# EAGLE design GaggiaBoard_V3 (EAGLE 9.6.2)

## Sheet 1 of 2
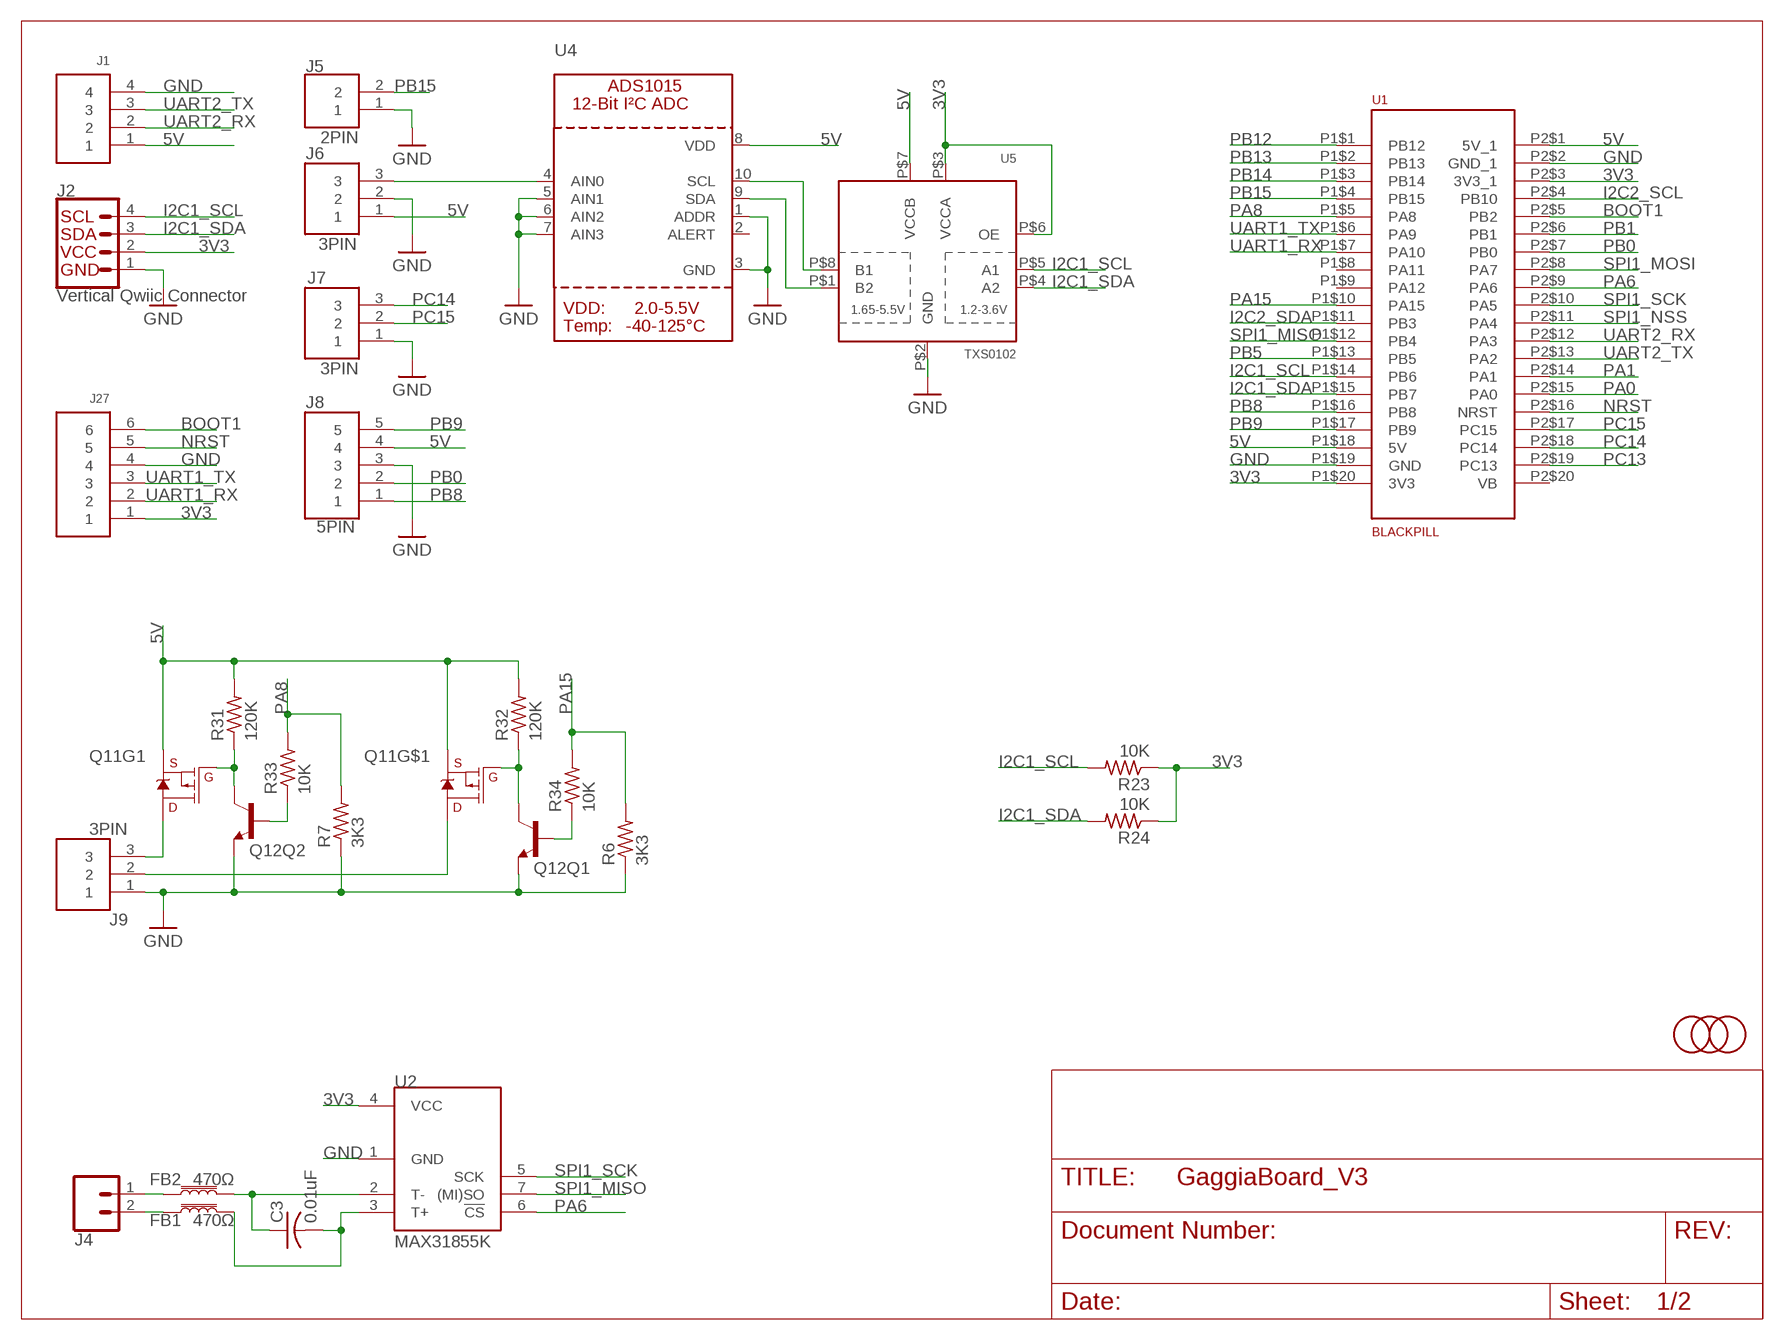
[diagram p0: schematic, sheet 1]

### Parts
C3  0.01uF  C-USC0603  [C0603]
FB1  470Ω  FERRITE_BEAD-0603-470Ω-100MHZ-1A-200MILIΩ  [0603]
FB2  470Ω  FERRITE_BEAD-0603-470Ω-100MHZ-1A-200MILIΩ  [0603]
J1  4PIN  [B4B-PH-K-S]
J2  Vertical Qwiic Connector  QWIIC_CONNECTOR  [JST04_1MM_VERT]
J4  CONN_023.5MM-NO_SILK  [SCREWTERMINAL-3.5MM-2-NS]
J5  2PIN  [B2B-PH-K-S]
J6  3PIN  [B3B-PH-K-S]
J7  3PIN  [B3B-PH-K-S]
J8  5PIN  [B5B-PH-K-S]
J9  3PIN  [B3B-PH-K-S]
J27  6PIN  [B6B-PH-K-S]
MARK1  FIDUCIAL  [FIDUCIAL_1MM]
MARK2  FIDUCIAL  [FIDUCIAL_1MM]
MARK5  FIDUCIAL  [FIDUCIAL_1MM]
Q11  MOSFET_PCH_DUAL-DMP2240UDM  [SOT26]
Q12  TRANS_NPN_DUAL-MBT3904DW1T1  [SC70-6]
R6  3K3  R-US_R0603  [R0603]
R7  3K3  R-US_R0603  [R0603]
R23  10K  R-US_R0603  [R0603]
R24  10K  R-US_R0603  [R0603]
R31  120K  R-US_R0603  [R0603]
R32  120K  R-US_R0603  [R0603]
R33  10K  R-US_R0603  [R0603]
R34  10K  R-US_R0603  [R0603]
U1  BLACKPILL  [BLACKPILL]
U2  MAX31855K  [SO08]
U4  ADC_ADS1015  [MSOP10]
U5  TXS0102  [VFSOP-8]

### Nets
3V3: J2.2 J27.1 R23.1 R24.1 U1.P1$20(3V3) U1.P2$3(3V3_1) U2.4(VCC) U5.P$3(VCCA) U5.P$6(OE) ; also sheet 2
5V: J1.1 J6.1 J8.4 Q11.S1(S) Q11.S2(S) R31.2 R32.2 U1.P1$18(5V) U1.P2$1(5V_1) U4.8(VDD) U5.P$7(VCCB) ; also sheet 2
BOOT1: J27.6 U1.P2$5(PB2)
GND: J1.4 J2.1 J5.1 J6.2 J7.1 J8.3 J9.1 J27.4 Q12.1(Q2:E) Q12.4(Q1:E) R6.1 R7.1 U1.P1$19(GND) U1.P2$2(GND_1) U2.1(GND) U4.1(ADDR) U4.3(GND) U4.5(AIN1) U4.6(AIN2) U4.7(AIN3) U5.P$2(GND) ; also sheet 2
I2C1_SCL: J2.4 R23.2 U1.P1$14(PB6) U5.P$5(A1)
I2C1_SDA: J2.3 R24.2 U1.P1$15(PB7) U5.P$4(A2)
I2C2_SCL: U1.P2$4(PB10)
I2C2_SDA: U1.P1$11(PB3)
N$3 [TC]: FB2.1 J4.1
N$4 [TC]: FB1.1 J4.2
N$5 [TC]: C3.1 FB2.2 U2.2(T-)
N$6: J9.3 Q11.D1(D)
N$10: J9.2 Q11.D2(D)
N$22: U4.10(SCL) U5.P$8(B1)
N$26 [TC]: C3.2 FB1.2 U2.3(T+)
N$38: U4.9(SDA) U5.P$1(B2)
N$46: Q12.2(Q2:B) R33.1
N$47: Q11.G2(G) Q12.3(Q1:C) R32.1
N$48: Q11.G1(G) Q12.6(Q2:C) R31.1
N$49: Q12.5(Q1:B) R34.1
NRST: J27.5 U1.P2$16(NRST)
PA0: U1.P2$15(PA0) ; also sheet 2
PA1: U1.P2$14(PA1) ; also sheet 2
PA6: U1.P2$9(PA6) U2.6(!CS)
PA8: R7.2 R33.2 U1.P1$5(PA8)
PA15: R6.2 R34.2 U1.P1$10(PA15)
PB0: J8.2 U1.P2$7(PB0)
PB1: U1.P2$6(PB1)
PB5: U1.P1$13(PB5)
PB8: J8.1 U1.P1$16(PB8)
PB9: J8.5 U1.P1$17(PB9)
PB12: U1.P1$1(PB12)
PB13: U1.P1$2(PB13)
PB14: U1.P1$3(PB14)
PB15: J5.2 U1.P1$4(PB15)
PC13: U1.P2$19(PC13) ; also sheet 2
PC14: J7.3 U1.P2$18(PC14)
PC15: J7.2 U1.P2$17(PC15)
PRESSURE [Analog]: J6.3 U4.4(AIN0)
SPI1_MISO: U1.P1$12(PB4) U2.7((MI)SO)
SPI1_MOSI: U1.P2$8(PA7)
SPI1_NSS: U1.P2$11(PA4)
SPI1_SCK: U1.P2$10(PA5) U2.5(SCK)
UART1_RX: J27.2 U1.P1$7(PA10)
UART1_TX: J27.3 U1.P1$6(PA9)
UART2_RX: J1.2 U1.P2$12(PA3)
UART2_TX: J1.3 U1.P2$13(PA2)
Unconnected: U1.P1$8(PA11) U1.P1$9(PA12) U1.P2$20(VB) U4.2(ALERT)

## Sheet 2 of 2
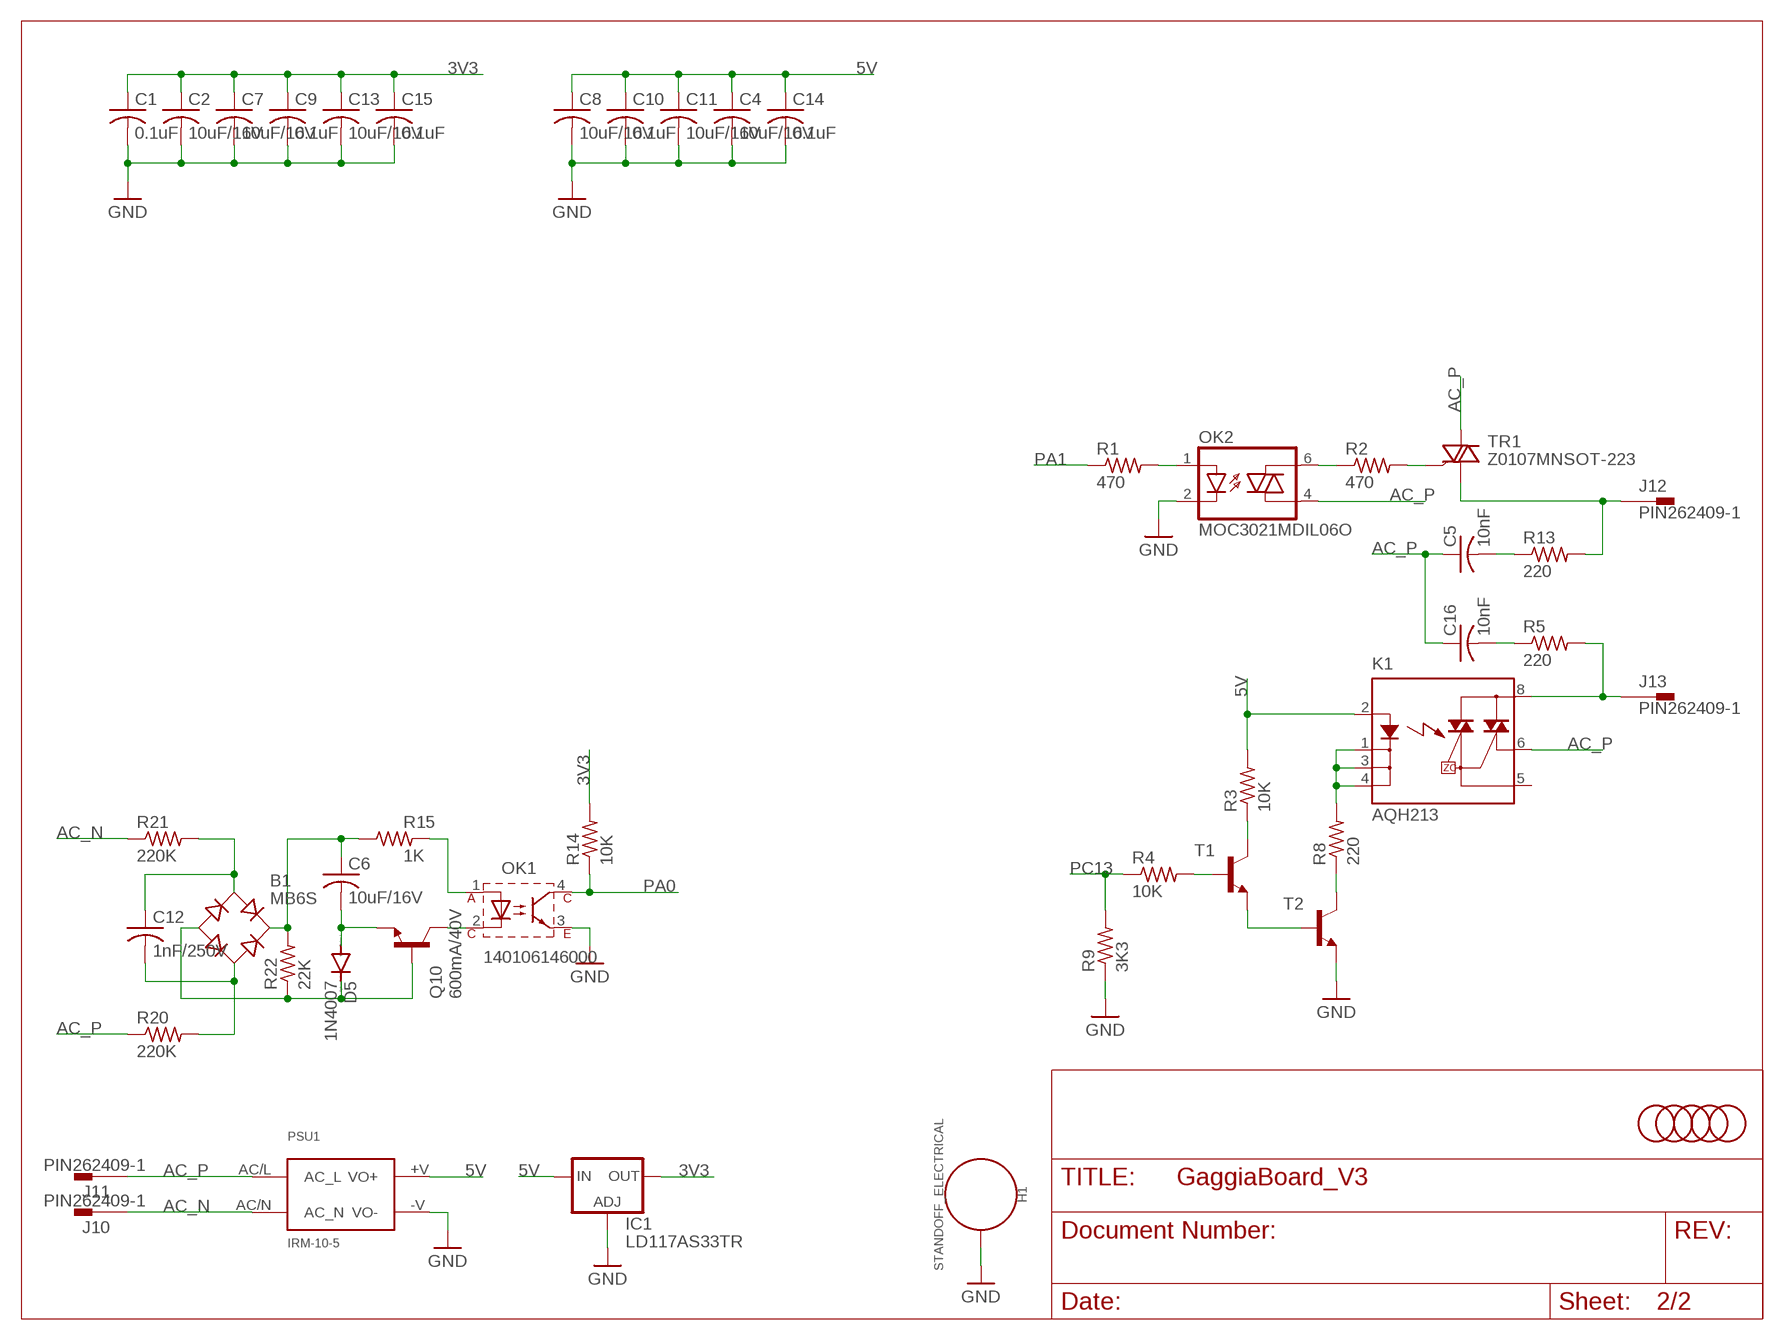
[diagram p1: schematic, sheet 2]

### Parts
B1  MB6S  [SOIC-4]
C1  0.1uF  C-USC0603  [C0603]
C2  10uF/16V  C-USC0603  [C0603]
C4  10uF/16V  C-USC0603  [C0603]
C5  10nF  C-USC1206  [C1206]
C6  10uF/16V  C-USC0603  [C0603]
C7  10uF/16V  C-USC0603  [C0603]
C8  10uF/16V  C-USC0603  [C0603]
C9  0.1uF  C-USC0603  [C0603]
C10  0.1uF  C-USC0603  [C0603]
C11  10uF/16V  C-USC0603  [C0603]
C12  1nF/250V  C-USC0603  [C0603]
C13  10uF/16V  C-USC0603  [C0603]
C14  0.1uF  C-USC0603  [C0603]
C15  0.1uF  C-USC0603  [C0603]
C16  10nF  C-USC1206  [C1206]
D5  1N4007  DIODE-DO214AC  [DO214AC]
H1  STANDOFF_ELECTRICAL  [STANDOFF-ELECTRICAL]
IC1  LD117AS33TR  [SOT223]
J10  PIN262409-1  [62409-1]
J11  PIN262409-1  [62409-1]
J12  PIN262409-1  [62409-1]
J13  PIN262409-1  [62409-1]
K1  AQH213  [DIL07]
MARK3  FIDUCIAL  [FIDUCIAL_1MM]
MARK4  FIDUCIAL  [FIDUCIAL_1MM]
MARK6  FIDUCIAL  [FIDUCIAL_1MM]
MARK7  FIDUCIAL  [FIDUCIAL_1MM]
MARK8  FIDUCIAL  [FIDUCIAL_1MM]
OK1  140106146000  WL-OCPT_SERIES_101X_140106146000  [WL-OCPT_LSOP4]
OK2  MOC3021MDIL06O  [DIL06O]
PSU1  IRM-10-5  [IRM-10]
Q10  600mA/40V  TRANS_NPN-MMBT2222AL  [SOT23-3]
R1  470  R-US_R0603  [R0603]
R2  470  R-US_R0603  [R0603]
R3  10K  R-US_R0603  [R0603]
R4  10K  R-US_R0603  [R0603]
R5  220  R-US_R2512  [R2512]
R8  220  R-US_R0603  [R0603]
R9  3K3  R-US_R0603  [R0603]
R13  220  R-US_R2512  [R2512]
R14  10K  R-US_R0603  [R0603]
R15  1K  R-US_R0603  [R0603]
R20  220K  R-US_R1206  [R1206]
R21  220K  R-US_R1206  [R1206]
R22  22K  R-US_R0603  [R0603]
T1  MMBT2222ALT1-NPN-SOT23-BEC  [SOT23-BEC]
T2  MMBT2222ALT1-NPN-SOT23-BEC  [SOT23-BEC]
TR1  Z0107MNSOT-223  [SOT223]

### Nets
3V3: C1.1 C2.1 C7.1 C9.1 C13.1 C15.1 IC1.4(OUT) R14.2 ; also sheet 1
3WAY: J13.A1 J13.A2 K1.8(DS1) R5.2
5V: C4.1 C8.1 C10.1 C11.1 C14.1 IC1.3(IN) K1.2(A) PSU1.+V(VO+) R3.2 ; also sheet 1
AC_N: J10.A1 J10.A2 PSU1.AC/N(AC_N) R21.1
AC_P: C5.1 C16.1 J11.A1 J11.A2 K1.6(DS3) OK2.4(A1) PSU1.AC/L(AC_L) R20.1 TR1.2(A2) TR1.4(A2)
GND: C1.2 C2.2 C4.2 C7.2 C8.2 C9.2 C10.2 C11.2 C13.2 C14.2 C15.2 H1.P1 IC1.1(ADJ) OK1.3 OK2.2(C) PSU1.-V(VO-) R9.1 T2.E ; also sheet 1
N$1: R3.1 T1.C
N$2: B1.- D5.C Q10.1(B) R22.1
N$7: OK1.2 Q10.3(C)
N$8: OK2.6(A2) R2.1
N$9: R2.2 TR1.3(G)
N$11: R8.1 T2.C
N$12: T1.E T2.B
N$13: K1.1(K) K1.3(K1) K1.4(K2) R8.2
N$14: R4.2 T1.B
N$15: C16.2 R5.1
N$16: C5.2 R13.1
N$36: B1.~1(AC1) C12.2 R20.2
N$37: B1.~2(AC2) C12.1 R21.2
N$39: OK2.1(A) R1.2
N$43: C6.2 D5.A Q10.2(E)
N$44: OK1.1 R15.2
N$45: B1.+ C6.1 R15.1 R22.2
PA0: OK1.4 R14.1 ; also sheet 1
PA1: R1.1 ; also sheet 1
PC13: R4.1 R9.2 ; also sheet 1
PUMP_P: J12.A1 J12.A2 R13.2 TR1.1(A1)
Unconnected: K1.5(DS2)

## Library data of the parts
B1 = rectifier:MB*S: Bridge Rectifier Source: http://www.fairchildsemi.com/ds/MB/MB6S.pdf; LCSC: C2487
C1 C9 C10 C14 C15 = rcl:C-US: CAPACITOR, American symbol; LCSC: C1591; SPICEPREFIX: C
C2 C4 C6-C8 C11 C13 = rcl:C-US: CAPACITOR, American symbol; LCSC: C86275; SPICEPREFIX: C
C3 = rcl:C-US: CAPACITOR, American symbol; LCSC: C100042; SPICEPREFIX: C
C5 C16 = rcl:C-US: CAPACITOR, American symbol; LCSC: C107192; SPICEPREFIX: C
C12 = rcl:C-US: CAPACITOR, American symbol; LCSC: C277510; SPICEPREFIX: C
D5 = diode:DIODE-: DIODE; LCSC: C727081
FB1 FB2 = SparkFun-Coils:FERRITE_BEAD: Ferrite Bead (blocks, cores, rings, chokes, etc.) Inductor with layers of ferrite used to suppress high frequencies. Often used to isolate high frequency noise. SparkFun Products: IOIO-OTG - V2.2 <https://www.sparkfun.com/products/13613> SparkFun SAMD21 Mini Breakout <https://www.sparkfun.com/products/13664> SparkFun 6 Degrees of Freedom Breakout - LSM6DS3 <https://www.sparkfun.com/products/13339> SparkFun SAMD21 Dev Breakout <https://www.sparkfun.com/products/13672>; LCSC: C883591; PROD_ID: NDUC-12579
H1 = SparkFun-Hardware:STANDOFF_ELECTRICAL: Stand Off Drill holes with an electrical connection. For example, use these to ground your board to a chassis. Example SparkFun Products Screw - Phillips Head (1/4", 4-40, 10 pack) <https://www.sparkfun.com/products/10453> (PRT-10453) Screw - Phillips Head (1/2", 4-40, 10 pack) <https://www.sparkfun.com/products/10452> (PRT-10452) Screw - Phillips Head (3/4", 4-40, 10 pack) <https://www.sparkfun.com/products/10451> (PRT-10451) Screw - Phillips Head (1", 4-40, 10 pack) <https://www.sparkfun.com/products/10450> (PRT-10450)
IC1 = v-reg:LD117A?*: Low drop fixed and adjustable positive voltage regulators 1 A Source: http://www.st.com/stonline/products/literature/ds/7194/ld1117axx.pdf; LCSC: C26537
J1 = jst_eph:4PIN; LCSC: C131334
J2 = SparkFun-Connectors:QWIIC_CONNECTOR: SparkFun I2C Standard Qwiic Connector An SMD 1mm pitch JST connector makes it easy and quick (get it? Qwiic?) to connect I2C devices to each other. The Qwiic system <http://www.sparkfun.com/qwiic> enables fast and solderless connection between popular platforms and various sensors and actuators. We carry 200mm <https://www.sparkfun.com/products/14204>, 100mm <https://www.sparkfun.com/products/14205>, 50mm <https://www.sparkfun.com/products/14206>, and breadboard friendly <https://www.sparkfun.com/products/14207> Qwiic cables. We also offer 10 pcs strips <https://www.sparkfun.com/products/14323> the SMD connectors.; LCSC: C160390; PROD_ID: CONN-14483
J4 = SparkFun-Connectors:CONN_02: Multi connection point. Often used as Generic Header-pin footprint for 0.1 inch spaced/style header connections On any of the 0.1 inch spaced packages, you can populate with these: Break Away Headers - Straight <https://www.sparkfun.com/products/116> (PRT-00116) Break Away Male Headers - Right Angle <https://www.sparkfun.com/products/553> (PRT-00553) Female Headers <https://www.sparkfun.com/products/115> (PRT-00115) Break Away Headers - Machine Pin <https://www.sparkfun.com/products/117> (PRT-00117) Break Away Female Headers - Swiss Machine Pin <https://www.sparkfun.com/products/743> (PRT-00743) For SCREWTERMINALS and SPRING TERMINALS visit here: Screw Terimnals on SparkFun.com <https://www.sparkfun.com/search/results?term=Screw+Terminals> (5mm/3.5mm/2.54mm spacing) This device is also useful as a general connection point to wire up your design to another part of your project. Our various solder wires solder well into these plated through hole pads. Hook-Up Wire - Assortment (Stranded, 22 AWG) <https://www.sparkfun.com/products/11375> (PRT-11375) Hook-Up Wire - Assortment (Solid Core, 22 AWG) <https://www.sparkfun.com/products/11367> (PRT-11367) View the entire wire category on our website here <https://www.sparkfun.com/categories/141> Special notes: Molex polarized connector foot print use with: PRT-08233 with associated crimp pins and housings. 2.54_SCREWTERM for use with PRT-10571. 3.5mm Screw Terminal footprints for PRT-08084 5mm Screw Terminal footprints for use with PRT-08432; LCSC: C474892; PROD_ID: CONN-08399
J5 = jst_eph:2PIN; LCSC: C131337
J6 J7 J9 = jst_eph:3PIN; LCSC: C131339
J8 = jst_eph:5PIN; LCSC: C157993
J10-J13 = con-faston:PIN2: Flachstecker Typ Tyco/Electronics/AMP TAB, FASTON Printed Circuit Board Tabs Source: http://www.buerklin.com, http://catalog.tycoelectronics.com; LCSC: C86495; OC_FARNELL: unknown; OC_NEWARK: unknown
J27 = jst_eph:6PIN; LCSC: C131342
K1 = relay:AQH*213: SOLID STATE RELAY NAiS Source: http://www.mew-europe.com/.. en_ds_61613_0000.pdf; LCSC: C719560; OC_FARNELL: unknown; OC_NEWARK: unknown
MARK1-MARK8 = adafruit:FIDUCIAL: For use by pick and place machines to calibrate the vision/machine, 1mm By microbuilder.eu
OK1 = Wurth_Optocoupler_WL-OCPT:WL-OCPT_SERIES_101X: WL-OCPT LSOP-4 Series 101x Characteristics High isolation voltage Good stability of inner isolation Stable CTR in full operation temperature range Different CTR binnings available High Collector-Emitter voltage Fast switching times Applications Power Supply, charger Computers & Microprocessors Office equipment Instrumental applications, machines Ammeter, Smart Meter <https://www.we-online.de/katalog/media/o198230v209%20WL-OCPT_LSOP4_101x_multi-parts.jpg> Details see: www.we-online.com/catalog/WL-OCPT_PACKAGE_LSOP-4 <www.we-online.com/catalog/WL-OCPT_PACKAGE_LSOP-4/?utm_source=eagle_model&utm_medium=description_link&utm_campaign=eisos_eagle> Updated by Ella Wu, 2022-06-21 2022 (C) Wurth Elektronik; CTR-MAX: 300%; CTR-MIN: 100%; DATASHEET-URL: https://www.we-online.com/redexpert/spec/140106146000?ae; IF: 60mA; LCSC: C141610; MOUNT: SMT; PART-NUMBER: 140106146000; TC-CTR: IF = 5mA,VCE = 5 V; VCE: 80V; VISO: 5000(V(RMS))
OK2 = discrete:MOC3021M: RANDOM-PHASE OPTOISOLATORS TRIAC DRIVER OUTPUT; LCSC: C5242
PSU1 = discrete:IRM-10-5: MEAN WELL IRM-10-5 5V 10W Output Switching Power Supply; LCSC: C2857903; SPICEPREFIX: E
Q10 = SparkFun-DiscreteSemi:TRANS_NPN: NPN transistor Current controlled devices typically used to amplify current or used as a switch. BC547 - COM-08928 <http://www.sparkfun.com/products/8928> (TO-92 45V 100mA) (1.Collector 2.Base 3.Emitter) 2N3904 - COM-00521 <http://www.sparkfun.com/products/521> (TO-92 40V 200mA) (1.Emitter 2.Base 3.Collector) P2N2222A - COM-12852 <http://www.sparkfun.com/products/12852> (TO-92 40V 600mA) (1.Collector 2.Base 3.Emitter); LCSC: C82460; PROD_ID: TRANS-08049
Q11 = SparkFun-DiscreteSemi:MOSFET_PCH_DUAL: Dual P-Channel -20VDS MOSFET Link to datasheet <http://www.diodes.com/_files/datasheets/ds31197.pdf> SparkFun Products: SparkFun FreeSoC2 Development Board <https://www.sparkfun.com/products/13229>; LCSC: C397948; PROD_ID: TRANS-12444; VALUE: 2A/20V/150mΩ
Q12 = SparkFun-DiscreteSemi:TRANS_NPN_DUAL: Dual NPN Transistors in Single Package The MBT3904W1 puts two general purpose 3904 NPN transistors in a single package. Datasheet <http://www.onsemi.com/pub_link/Collateral/MBT3904DW1T1-D.PDF> SparkFun Products: SparkFun ESP32 Thing <https://www.sparkfun.com/products/13907>; LCSC: C896759; PROD_ID: TRANS-13337
R1 R2 = rcl:R-US_: RESISTOR, American symbol; LCSC: C114669; SPICEPREFIX: R
R3 R4 R14 R23 R24 R33 R34 = rcl:R-US_: RESISTOR, American symbol; LCSC: C98220; SPICEPREFIX: R
R5 R13 = rcl:R-US_: RESISTOR, American symbol; LCSC: C877859; SPICEPREFIX: R
R6 R7 R9 = rcl:R-US_: RESISTOR, American symbol; LCSC: C114432; SPICEPREFIX: R
R8 = rcl:R-US_: RESISTOR, American symbol; LCSC: C107696; SPICEPREFIX: R
R15 = rcl:R-US_: RESISTOR, American symbol; LCSC: C22548; SPICEPREFIX: R
R20 R21 = rcl:R-US_: RESISTOR, American symbol; LCSC: C130275; SPICEPREFIX: R
R22 = rcl:R-US_: RESISTOR, American symbol; LCSC: C114065; SPICEPREFIX: R
R31 R32 = rcl:R-US_: RESISTOR, American symbol; LCSC: C114607; SPICEPREFIX: R
T1 T2 = transistor:*-NPN-: NPN Transistror BF959 corrected 2008.03.06; LCSC: C82460
TR1 = discrete:Z0107MN: Triacs 1.0 Amp 600 Volt; LCSC: C71218
U1 = discrete:BLACKPILL: STM32 BlackPill
U2 = SparkFun-IC-Conversion:MAX31855K: Cold-Junction-Compensated K-Thermocoupleto-Digital Converter (-270°C to +1800°C) The MAX31855K performs cold-junction compensation and digitizes the signal from a type-K thermocouple. The data is output in a 14-bit resolution, SPI™-compatible, read-only format. This converter resolves temperatures to 0.25°C, allows readings as high as +1800°C and as low as -270°C, and exhibits thermocouple accuracy of ±2°C for temperatures ranging from -200°C to +700°C for K-type thermocouples. Datasheet <https://cdn.sparkfun.com/datasheets/Sensors/Temp/MAX31855K.pdf> SparkFun Products SparkFun Thermocouple Breakout - MAX31855K <https://www.sparkfun.com/products/13266> (SEN-13266); LCSC: C52028; PROD_ID: IC-12578
U4 = microbuilder:ADC_ADS1015: ADS1015 - 12-bit 4-Channel I2C ADC with Internal PGA VDD: 2.0-5.5V Sampling Rate: 3.3ksps Gain Settings: 2/3, 1, 2, 4, 8, 16 I2C Address: ADDR low = 1001000x, ADDR high = 1001001x Internal Comparator The ADS1015 includes an internal comparator that can be set to output a high-level on ALERT when the conversion results exceeeds a pre-defined upper level, and will deassert itself when the level falls below a pre-defined lower threshold level. It can also be set to windowed mode where the ALERT pin will be asserted if the data exceeds the upper threshold or falls below the lower threshold.; LCSC: C193969
U5 = adafruit:TXS0102: 2-Bit Bi-Directional Level Shifter (I2C, etc.) Designed for I2C devices and has internal pullups. Not to be confused with TXB010x series. 1.2V-3.6V (VCCA) to 1.65V-5.5V (VCCB) bi-directional level shifter with auto direction sensing. Max data rate - 24Mbps (Push Pull), 2Mbps (Open Drain) Digikey: 296-21931-1-ND; LCSC: C53434

## Net classes
1 TC: clearance 0.508 mm
2 Analog: clearance 0.254 mm

## Board
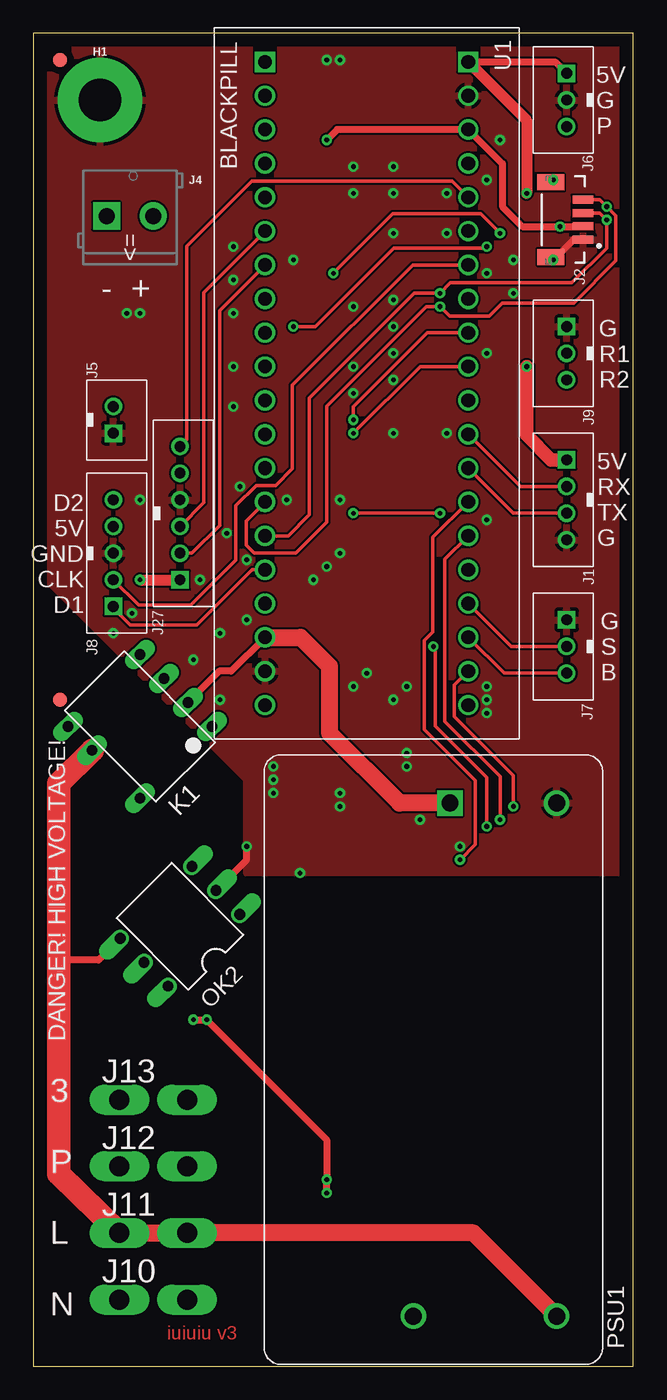
[diagram p2: board, top side]
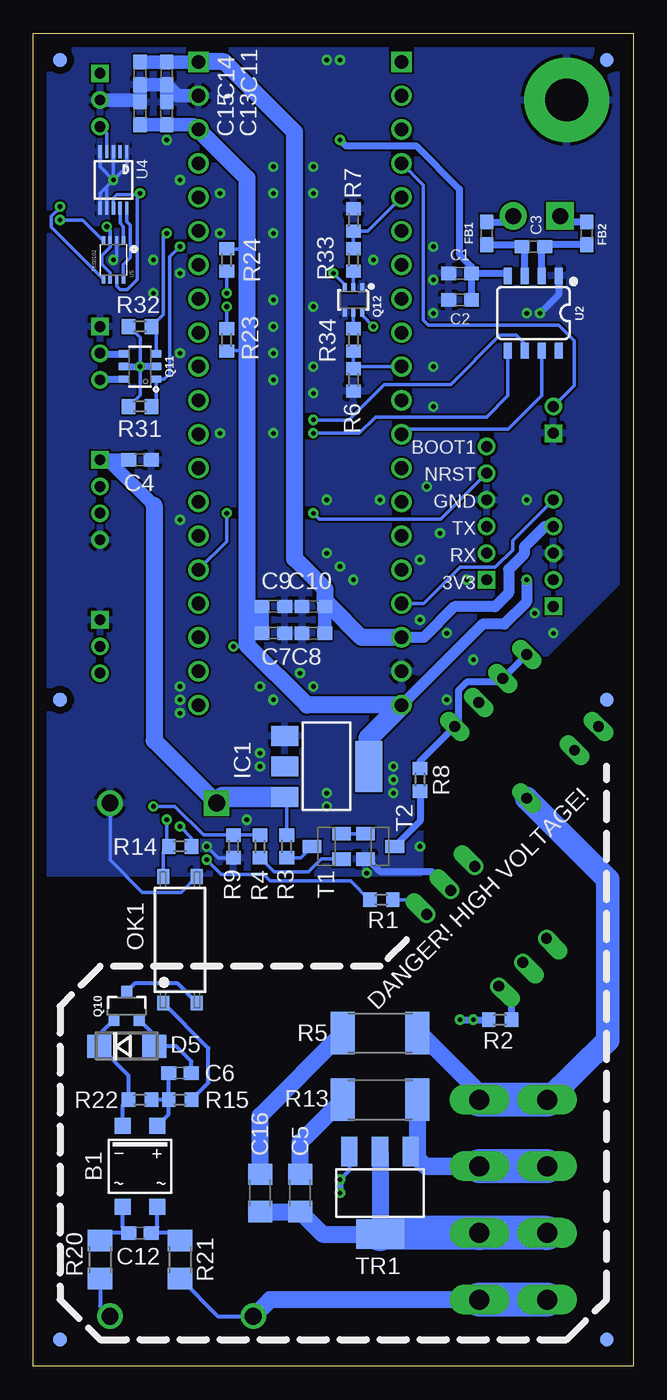
[diagram p3: board, bottom side, seen from below]

Size 45 x 100 mm. Coordinates in mm from the lower left corner, seen from the top.
Outline: 0,0 45,0 45,100 0,100 0,0
Copper layers (1*16): Top 0.035mm / dielectric 1.5mm / Bottom 0.035mm
Design rules "default *": minimum track width 6mil, minimum drill 0.35mm, track to track 6mil, track to pad 6mil, pad to pad 6mil, via to via 6mil, smd to smd 6mil, copper to edge 40mil, drill to drill 6mil, minimum pad ring 10mil, minimum via ring 8mil, stop-mask expansion 4mil, vias tented up to drill 100mil, thermal gap 10mil

### Footprints (pad centres in the part's own frame; a part is rotated, then mirrored left to right if it is on the bottom)
SOIC-4 = smd 1.2 x 1.2: + 1.3,3.05; - -1.3,3.05; ~1 -1.3,-3.05; ~2 1.3,-3.05
C0603 = smd 1.1 x 1: 1 -0.85,0; 2 0.85,0
C1206 = smd 1.6 x 1.8: 1 -1.4,0; 2 1.4,0
DO214AC = smd 1.8 x 1.7: A 2.05,0; C -2.05,0
0603 = smd 1.1 x 1: 1 -0.85,0; 2 0.85,0
STANDOFF-ELECTRICAL = drill 3.2 pad 6.35: P1 0,0
SOT223 = smd 1.5 x 2: 1 -2.3,-3.15; 2 0,-3.15; 3 2.3,-3.15 | smd 3.8 x 2: 4 0,3.15
B4B-PH-K-S = drill 0.813 square: 1 3,0 | drill 0.813: 2 1,0; 3 -1,0; 4 -3,0
JST04_1MM_VERT = smd 0.6 x 1.55: 1 -1.478,0.775; 2 -0.478,0.775; 3 0.522,0.775; 4 1.522,0.775 | smd 1.2 x 2: NC1 -2.778,3.2; NC2 2.822,3.2
SCREWTERMINAL-3.5MM-2-NS = drill 1.2 pad 2.032 square: 1 0,0 | drill 1.2 pad 2.032: 2 3.5,0
B2B-PH-K-S = drill 0.813 square: 1 2,0 | drill 0.813: 2 0,0
B3B-PH-K-S = drill 0.813 square: 1 2,0 | drill 0.813: 2 0,0; 3 -2,0
B5B-PH-K-S = drill 0.813 square: 1 4,0 | drill 0.813: 2 2,0; 3 0,0; 4 -2,0; 5 -4,0
62409-1 = drill 1.5 pad 1.9 long: A1 -2.54,0; A2 2.54,0
B6B-PH-K-S = drill 0.813 square: 1 5,0 | drill 0.813: 2 3,0; 3 1,0; 4 -1,0; 5 -3,0; 6 -5,0
DIL07 = drill 0.8 long: 1 -3.81,-3.81; 2 -1.27,-3.81; 3 1.27,-3.81; 4 3.81,-3.81; 5 3.81,3.81; 6 1.27,3.81; 8 -3.81,3.81
FIDUCIAL_1MM = smd 1 x 1: 1 0,0
WL-OCPT_LSOP4 = smd 1.1 x 0.9: 1 -4.75,1.27; 2 -4.75,-1.27; 3 4.75,-1.27; 4 4.75,1.27
DIL06O = drill 0.813 offset: 1 -2.54,-3.81; 2 0,-3.81; 3 2.54,-3.81; 4 2.54,3.81; 5 0,3.81; 6 -2.54,3.81
IRM-10 = drill 1.27 square: +V 19.25,-1.25 | drill 1.27: -V 19.25,-9.25; AC/L -19.25,-9.25; AC/N -19.25,1.5
SOT23-3 = smd 0.8 x 0.9: 1 -0.95,-1; 2 0.95,-1; 3 0,1.1
SOT26 = smd 0.55 x 0.8: D1 -0.95,1.2; D2 0.95,1.2; G1 -0.95,-1.2; G2 0.95,-1.2; S1 0,1.2; S2 0,-1.2
SC70-6 = smd 0.3 x 0.66: 1 -0.65,-0.92; 2 0,-0.92; 3 0.65,-0.92; 4 0.65,0.92; 5 0,0.92; 6 -0.65,0.92
R0603 = smd 1 x 1.1: 1 -0.85,0; 2 0.85,0
R2512 = smd 1.8 x 3.2: 1 -2.8,0; 2 2.8,0
R1206 = smd 1.6 x 1.803: 1 -1.422,0; 2 1.422,0
SOT23-BEC = smd 1 x 1.4: B -0.95,-1.1; C 0,1.1; E 0.95,-1.1
SOT223' = smd 1.219 x 2.235: 1 -2.311,-3.099; 2 0,-3.099; 3 2.311,-3.099 | smd 3.6 x 2.2: 4 0,3.099
BLACKPILL = drill 1.016 square: P1$1 -22.86,-7.62; P2$1 -22.86,7.62 | drill 1.016: P1$2 -20.32,-7.62; P1$3 -17.78,-7.62; P1$4 -15.24,-7.62; P1$5 -12.7,-7.62; P1$6 -10.16,-7.62; P1$7 -7.62,-7.62; P1$8 -5.08,-7.62; P1$9 -2.54,-7.62; P1$10 0,-7.62; P1$11 2.54,-7.62; P1$12 5.08,-7.62; P1$13 7.62,-7.62; P1$14 10.16,-7.62; P1$15 12.7,-7.62; P1$16 15.24,-7.62; P1$17 17.78,-7.62; P1$18 20.32,-7.62; P1$19 22.86,-7.62; P1$20 25.4,-7.62; P2$2 -20.32,7.62; P2$3 -17.78,7.62; P2$4 -15.24,7.62; P2$5 -12.7,7.62; P2$6 -10.16,7.62; P2$7 -7.62,7.62; P2$8 -5.08,7.62; P2$9 -2.54,7.62; P2$10 0,7.62; P2$11 2.54,7.62; P2$12 5.08,7.62; P2$13 7.62,7.62; P2$14 10.16,7.62; P2$15 12.7,7.62; P2$16 15.24,7.62; P2$17 17.78,7.62; P2$18 20.32,7.62; P2$19 22.86,7.62; P2$20 25.4,7.62
SO08 = smd 0.6 x 1.2: 1 -1.905,-2.8; 2 -0.635,-2.8; 3 0.635,-2.8; 4 1.905,-2.8; 5 1.905,2.8; 6 0.635,2.8; 7 -0.635,2.8; 8 -1.905,2.8
MSOP10 = smd 0.25 x 1: 1 -1,-2.113; 2 -0.5,-2.113; 3 0,-2.113; 4 0.5,-2.113; 5 1,-2.113; 6 1,2.113; 7 0.5,2.113; 8 0,2.113; 9 -0.5,2.113; 10 -1,2.113
VFSOP-8 = smd 0.25 x 0.65: P$1 -0.75,-1.45; P$2 -0.25,-1.45; P$3 0.25,-1.45; P$4 0.75,-1.45; P$5 0.75,1.45; P$6 0.25,1.45; P$7 -0.25,1.45; P$8 -0.75,1.45

### Placement (x,y rotation side)
B1  37,15 0 bottom
C1  13,82 180 bottom
C2  13,80 180 bottom
C3  7.5,84 180 bottom
C4  37,68 0 bottom
C5  25,13 90 bottom
C6  34,22 0 bottom
C7  27,55 0 bottom
C8  24,55 180 bottom
C9  27,57 0 bottom
C10  24,57 180 bottom
C11  35,97 270 bottom
C12  37,10 180 bottom
C13  35,94 90 bottom
C14  37,97 270 bottom
C15  37,94 90 bottom
C16  28,13 90 bottom
D5  38,24 0 bottom
FB1  11,85 270 bottom
FB2  3.5,85 270 bottom
H1  5,95 0 top
IC1  23,45 270 bottom
J1  40,65 90 top
J2  42,86 90 top
J4  5.5,86.3 0 top
J5  6,72 270 top
J6  40,95 90 top
J7  40,54 90 top
J8  6,61 270 top
J9  40,76 90 top
J10  9,5 0 top
J11  9,10 0 top
J12  9,15 0 top
J13  9,20 0 top
J27  11,64 270 top
K1  8,48 135 top
MARK1  43,2 0 bottom
MARK2  2,50 0 bottom
MARK3  43,50 0 bottom
MARK4  2,2 0 bottom
MARK5  43,98 0 bottom
MARK6  2,98 0 bottom
MARK7  2,98 0 top
MARK8  2,50 0 top
OK1  34,32 90 bottom
OK2  11,33 135 top
PSU1  30,23 90 top
Q10  38,27 0 bottom
Q11  37,75 90 bottom
Q12  21,80 180 bottom
R1  18.9,35 0 bottom
R2  10,26 180 bottom
R3  26,39 90 bottom
R4  28,39 270 bottom
R5  19,25 0 bottom
R6  21,74 90 bottom
R7  21,86 270 bottom
R8  16,44 90 bottom
R9  30,39 90 bottom
R13  19,20 0 bottom
R14  34,39 0 bottom
R15  34,20 0 bottom
R20  40,8 90 bottom
R21  34,8 90 bottom
R22  37,20 0 bottom
R23  30.5,77 90 bottom
R24  30.5,83 270 bottom
R31  37,72 180 bottom
R32  37,78 180 bottom
R33  21,83 90 bottom
R34  21,77 270 bottom
T1  23,39 90 bottom
T2  19,39 270 bottom
TR1  Z0107MNSOT-223  [SOT223']  19,13 180 bottom
U1  25,75 270 top
U2  7.5,79 180 bottom
U4  39,89 180 bottom
U5  39,83 180 bottom

### Tracks (layer width: path | path; a pad name or v marks a point on that pad's centre or on a via)
3V3  (via drill 0.35)
  Top 0.254: v34,40.5 34,44.16 30.13,48.04 30.13,53.87 v30,54
  Top 0.508: J2.2 41.2,85.5 v39.5,85.5 36.67,85.5 35.18,87 35.18,90.22 U1.P2$3 22.78,92.78 v22,92
  Top 0.813: v8,59 J27.1
  Bottom 0.254: v39.5,85.5 39.25,85.25 U5.P$3 39.25,83.94 39.88,83.31 39.88,82.68 39.25,82.05 U5.P$6 | R14.2 33.15,39.65 v34,40.5 | R23.1 30.45,76.2 28.98,76.2 | R24.1 30.47,83.82 28.98,83.82 | v30,54 29.09,54 28.98,54.11
  Bottom 0.508: C1.1 9.61,82 U2.4 | C1.1 C2.1 | C1.1 12.15,82.51 13.04,83.4 13.04,88.31 16.26,91.53 21.54,91.53 v22,92
  Bottom 0.813: v8,59 8,57.35 9.68,55.67 11.31,55.67 U1.P1$20
  Bottom 1.016: C7.1 C9.1 27.95,56.9 28.98,56.9 | C15.1 C13.1 32.99,93.15 U1.P2$3
  Bottom 1.27: U1.P2$3 28.98,89.14 28.98,83.82 28.98,76.2 28.98,56.9 28.98,54.11 24.47,49.6 U1.P1$20
  Bottom 1.524: U1.P1$20 19.85,47.13 IC1.4
3WAY
  Bottom 1.27: R5.2 16.02,25 11.65,20.64 J13.A2
  Bottom 1.778: J13.A1 1.91,24.45 1.91,36.52 K1.8
  Bottom 2.54: J13.A1 J13.A2
5V  (via drill 0.35)
  Top 0.508: U1.P2$1 39.14,97.86 J6.1 | K1.2 13.94,52.14 14.84,52.14 U1.P1$18
  Top 0.813: U1.P2$1 37,93.48 v37,88
  Top 1.016: v37,75 37,69.85 38.85,68 J1.1
  Top 1.27: U1.P1$18 20.05,54.68 22.21,52.52 22.21,47.52 27.47,42.25 PSU1.+V
  Bottom 0.254: U4.8 39,87.62 38.73,87.88 37.12,87.88 v37,88 37.21,87.79 37.21,81.53 37.97,80.77 38.48,80.77 38.75,81.04 U5.P$7 | R32.2 37,77.15 v37,75 37,72.85 R31.2 | R3.2 26,42.55 IC1.3
  Bottom 0.508: Q11.S1 v37,75 Q11.S2
  Bottom 0.813: J8.4 6.63,63 8.15,61.49 8.15,60.98 9.35,59.77 9.35,57.99 10.37,56.98 13.42,56.98 15.72,54.68 U1.P1$18
  Bottom 1.016: C8.1 C10.1 22.76,57 22.73,57.02 | U1.P2$1 C11.1 C14.1 | C4.1 J1.1 39.37,68 35.94,64.58
  Bottom 1.27: PSU1.+V 35.94,46.94 35.94,64.58 | U1.P1$18 20.39,54.68 22.73,57.02 23.11,57.4 23.11,58.29 25.4,60.58 25.4,92.58 30.68,97.86 U1.P2$1
  Bottom 1.524: IC1.3 30.8,42.7 PSU1.+V
AC_N
  Bottom 0.305: R21.1 31.17,3.75 PSU1.AC/N
  Bottom 1.27: PSU1.AC/N 27.25,5 J10.A2
  Bottom 2.54: J10.A1 J10.A2
AC_P
  Top 0.508: 1.91,30.48 4.89,30.48 OK2.4
  Top 1.27: PSU1.AC/L 33,10 J11.A2 J11.A1
  Top 1.778: J11.A1 1.91,14.45 1.91,30.48 1.91,43.7 K1.6
  Bottom 0.305: R20.1 40,4.5 PSU1.AC/L
  Bottom 1.27: TR1.2 19,10.1 18.9,10 | C16.1 C5.1 23.3,9.9 TR1.4
  Bottom 2.54: J11.A1 J11.A2 18.9,10 TR1.4
BOOT1
  Top 0.254: J27.6 11.51,69.51 11.51,84.03 16.38,88.9 31.42,88.9 U1.P2$5
GND  (via drill 0.35)
  Top 0.508: v39,83 40.52,84.52 J2.1 | OK2.2 16,38 v16,39
  Bottom 0.254: U4.5 40,90 v39,89 | U4.3 v39,89 | U4.1 38,90 v39,89 | U4.6 40,88 v39,89 | U4.7 39.5,88.5 v39,89 | U5.P$2 38.75,83.25 v39,83 | OK1.3 33.92,35.56 36.83,35.56 39.25,37.98 PSU1.-V | R9.1 31.15,38.15 v32,39
  Bottom 0.508: U2.1 5.59,80.41 v7,79 | OK2.2 15.08,37.08 18.97,37.08 19.68,37.78 19.84,37.78 T2.E
  Bottom 1.016: C13.2 C11.2 | C11.2 34.17,95.32 U1.P2$2 | C11.2 C14.2 C15.2 37.15,95 J6.2
  other vias: 8,79 24,79.5 36,83 34,82 14.5,62.5 8,65 15.5,66 16,56 21,59 22,60 23,61 23,43 23,42 28,45 28,46 27,70 27,74 34,63.5 34,49 34,51 34,50 31,70 34,76 15,72 15,75 34,89 35,92 23,98 22,98 24,88 27,88 27,85 31,85 27,80 24,90 27,90 15,84 15,79 31,88 19,65 23,65 27,78 27,76 24,75 24,73 16,60.5 7.4,56.5 36,80.5 15,81.5 6,55 12,53 14,55 14,50 20,37 29,41 27,50 28,51 12.5,59 18,45 25,52 24,51 18,44 18,43 19.5,83
  pour Top: 0,100 45,100 45,37 16,37 16,44 0,60
  pour Bottom: 0,100 45,100 45,37 16,37 16,44 0,60
I2C1_SCL  (via drill 0.35)
  Top 0.254: J2.4 42.48,87.52 v43,87 43.69,86.31 43.69,82.93 40.51,79.76 35.17,79.76 34.19,78.78 31.21,78.78 v30.5,79.5 29.46,79.5 22,72.03 22,63.33 19.67,61.01 16.57,61.01 15.96,61.62 15.96,63.42 U1.P1$14
  Bottom 0.254: v43,87 43,86.93 43.66,86.27 43.66,85.46 U5.P$5 | v30.5,79.5 R23.2
I2C1_SDA  (via drill 0.35)
  Top 0.254: J2.3 42.48,86.52 v43,86 43,83.89 40.39,81.28 31.28,81.28 v30.5,80.5 28.56,80.5 20.7,72.64 20.7,63.88 19.12,62.3 U1.P1$15
  Bottom 0.254: v43,86 41.3,86 U5.P$4 | v30.5,80.5 R24.2
N$1
  Bottom 0.254: T1.C 24.95,38.15 R3.1
N$2
  Bottom 0.305: B1.- 38.3,19.55 R22.1 37.85,21.8 39.84,23.79 | 39.84,23.79 D5.C | Q10.1 39.84,25.11 39.84,23.79
N$3
  Bottom 0.508: FB2.1 5.05,85.85 J4.1
N$4
  Bottom 0.508: FB1.1 9.45,85.85 J4.2
N$5
  Bottom 0.508: FB2.2 6.5,84.15 C3.1 6.87,83.78 U2.2
N$6
  Bottom 0.508: J9.3 39.95,74.05 Q11.D1
N$7
  Bottom 0.305: OK1.2 34.18,28.7 37.4,28.7 Q10.3
N$8
  Bottom 0.508: OK2.6 9.15,27.56 R2.1
N$9  (via drill 0.35)
  Top 0.508: v22,13 v22,14 22,17 v13,26 v12,26
  Bottom 0.305: TR1.3 21.31,14.69 v22,14
  Bottom 0.508: R2.2 v12,26 v13,26 | v22,13 v22,14
N$10
  Bottom 0.508: J9.2 39.95,75.95 Q11.D2
N$11
  Bottom 0.508: R8.1 16,40.9 T2.C
N$12
  Bottom 0.254: T2.B T1.E
N$13
  Bottom 0.508: R8.2 16,45.39 K1.1 13.12,48.27 13.12,50.7 12.49,51.32 10.07,51.32 K1.3 | K1.4 K1.3 | K1.3
N$14
  Bottom 0.254: T1.B 23.42,38.05 24.38,37.08 26.93,37.08 R4.2
N$15
  Bottom 1.27: C16.2 28,18.8 R5.1
N$16
  Bottom 1.27: C5.2 25,16.8 R13.1
N$22
  Bottom 0.254: U5.P$8 38.25,82.65 37.72,83.19 37.72,85.6 38,85.88 U4.10
N$26
  Bottom 0.508: FB1.2 8.5,84.15 C3.2 8.13,83.78 U2.3
N$36
  Bottom 0.305: B1.~1 38.3,10.45 C12.2 39.42,10 R20.2
N$37
  Bottom 0.305: R21.2 34.58,10 C12.1 35.7,10.45 B1.~2
N$38
  Bottom 0.254: U5.P$1 38.25,85.49 38.5,85.74 U4.9
N$39
  Bottom 0.254: OK2.1 16.59,35 R1.2
N$43
  Bottom 0.305: C6.2 33.15,22.86 34.29,24 D5.A 35.95,24.9 Q10.2
N$44
  Bottom 0.305: R15.2 31.88,21.27 31.88,23.86 OK1.1
N$45
  Bottom 0.305: B1.+ 34.85,18.9 R15.1 | R15.1 R22.2 | R15.1 C6.1
N$46
  Bottom 0.254: Q12.2 R33.1
N$47  (via drill 0.35)
  Top 0.254: v35,85 33.55,86.45 26.95,86.45 v22.5,82
  Bottom 0.254: Q11.G2 35.8,77.65 R32.1 35.25,78.9 35.25,84.75 v35,85 | Q12.3 21.65,81.15 v22.5,82
N$48  (via drill 0.35)
  Top 0.254: v34,84 33.87,83.87 27.02,83.87 21.15,78 v19.5,78
  Bottom 0.254: R31.1 35.8,72.35 Q11.G1 35.17,74.05 34.76,74.46 34.76,83.24 v34,84 | Q12.6 20.35,78.85 v19.5,78
N$49
  Bottom 0.254: R34.1 Q12.5
NRST  (via drill 0.35)
  Top 0.254: v24,64 v30.5,64
  Bottom 0.254: v30.5,64 30.5,61.88 U1.P2$16 | v24,64 23.55,63.55 14.46,63.55 J27.5
PA0  (via drill 0.35)
  Top 0.254: U1.P2$15 30.86,60.54 30.86,48.39 35,44.25 v35,41
  Bottom 0.254: R14.1 35,38.85 | 35,38.85 35.27,38.58 OK1.4 | v35,41 35,38.85
PA1  (via drill 0.35)
  Top 0.254: U1.P2$14 29.97,62.19 29.97,55.07 29.34,54.44 29.34,47.75 33.15,43.94 33.15,39.15 v32,38
  Bottom 0.254: v32,38 30.91,36.91 27.73,36.91 27.22,36.4 21.21,36.4 19.81,35 R1.1
PA6  (via drill 0.35)
  Top 0.254: U1.P2$9 29.54,77.54 24,72 v24,71
  Bottom 0.254: U2.6 8.13,76.71 8.77,77.34 10.02,77.34 13.7,73.66 18.67,73.66 21.33,71 v24,71
PA8
  Bottom 0.254: U1.P1$5 19.93,85.15 R7.2 R33.2
PA15
  Bottom 0.254: R34.2 R6.2 20.85,75 U1.P1$10
PB0
  Top 0.254: J8.2 7.91,57.09 11.79,57.09 15.2,60.5 15.2,64.56 16.72,66.08 18.19,66.08 19.44,67.33 19.44,73.61 28.45,82.62 U1.P2$7
PB8
  Top 0.254: J8.1 6,56.87 7.27,55.6 12.27,55.6 16.43,59.76 U1.P1$16
PB9
  Bottom 0.254: U1.P1$17 15.71,57.22 12.99,59.94 10.35,59.94 9.04,61.25 9.04,61.96 J8.5
PB15
  Bottom 0.254: J5.2 4.45,73.56 4.45,76.96 5.59,78.11 15.39,78.11 15.75,78.47 15.75,88.61 U1.P1$4
PC13  (via drill 0.35)
  Top 0.254: v36,42 36,44.33 31.58,48.75 31.58,51.1 U1.P2$19
  Bottom 0.254: v36,42 34.38,42 32.23,39.85 R9.2 R4.1
PC14
  Top 0.254: U1.P2$18 35.3,52 J7.3
PC15
  Top 0.254: U1.P2$17 35.84,54 J7.2
PRESSURE
  Bottom 0.254: U4.4 39.5,92.5 J6.3
PUMP_P
  Bottom 1.27: TR1.1 15.59,15 J12.A2 15.59,15 16.2,15.61 R13.2
  Bottom 2.54: J12.A1 J12.A2
SPI1_MISO
  Bottom 0.254: U2.7 6.87,72.82 9.38,70.3 17,70.3 U1.P1$12
SPI1_SCK  (via drill 0.35)
  Top 0.254: U1.P2$10 29,75 v24,70
  Bottom 0.254: v24,70 20.55,70 19.34,71.22 11.01,71.22 9.4,72.82 U2.5
UART1_RX
  Top 0.254: J27.2 11.89,61 13.97,63.08 13.97,79.21 U1.P1$7
UART1_TX
  Top 0.254: U1.P1$6 12.78,80.56 12.78,64.78 J27.3
UART2_RX
  Top 0.254: U1.P2$12 36.54,66 J1.2
UART2_TX
  Top 0.254: U1.P2$13 36,64 J1.3

### Text on the board
Top: iuiuiu v3
tPlace: 5V / G / P | <= | - + | G / R1 / R2 | 5V / RX / TX / G | D2 / 5V / GND / CLK / D1 | G / S / B | DANGER! HIGH VOLTAGE! | 3 / / P / / L / / N
bPlace: BOOT1 / NRST / GND / TX / RX / 3V3 | DANGER! HIGH VOLTAGE!